# EAGLE design uC_Board (EAGLE 9.0.0)
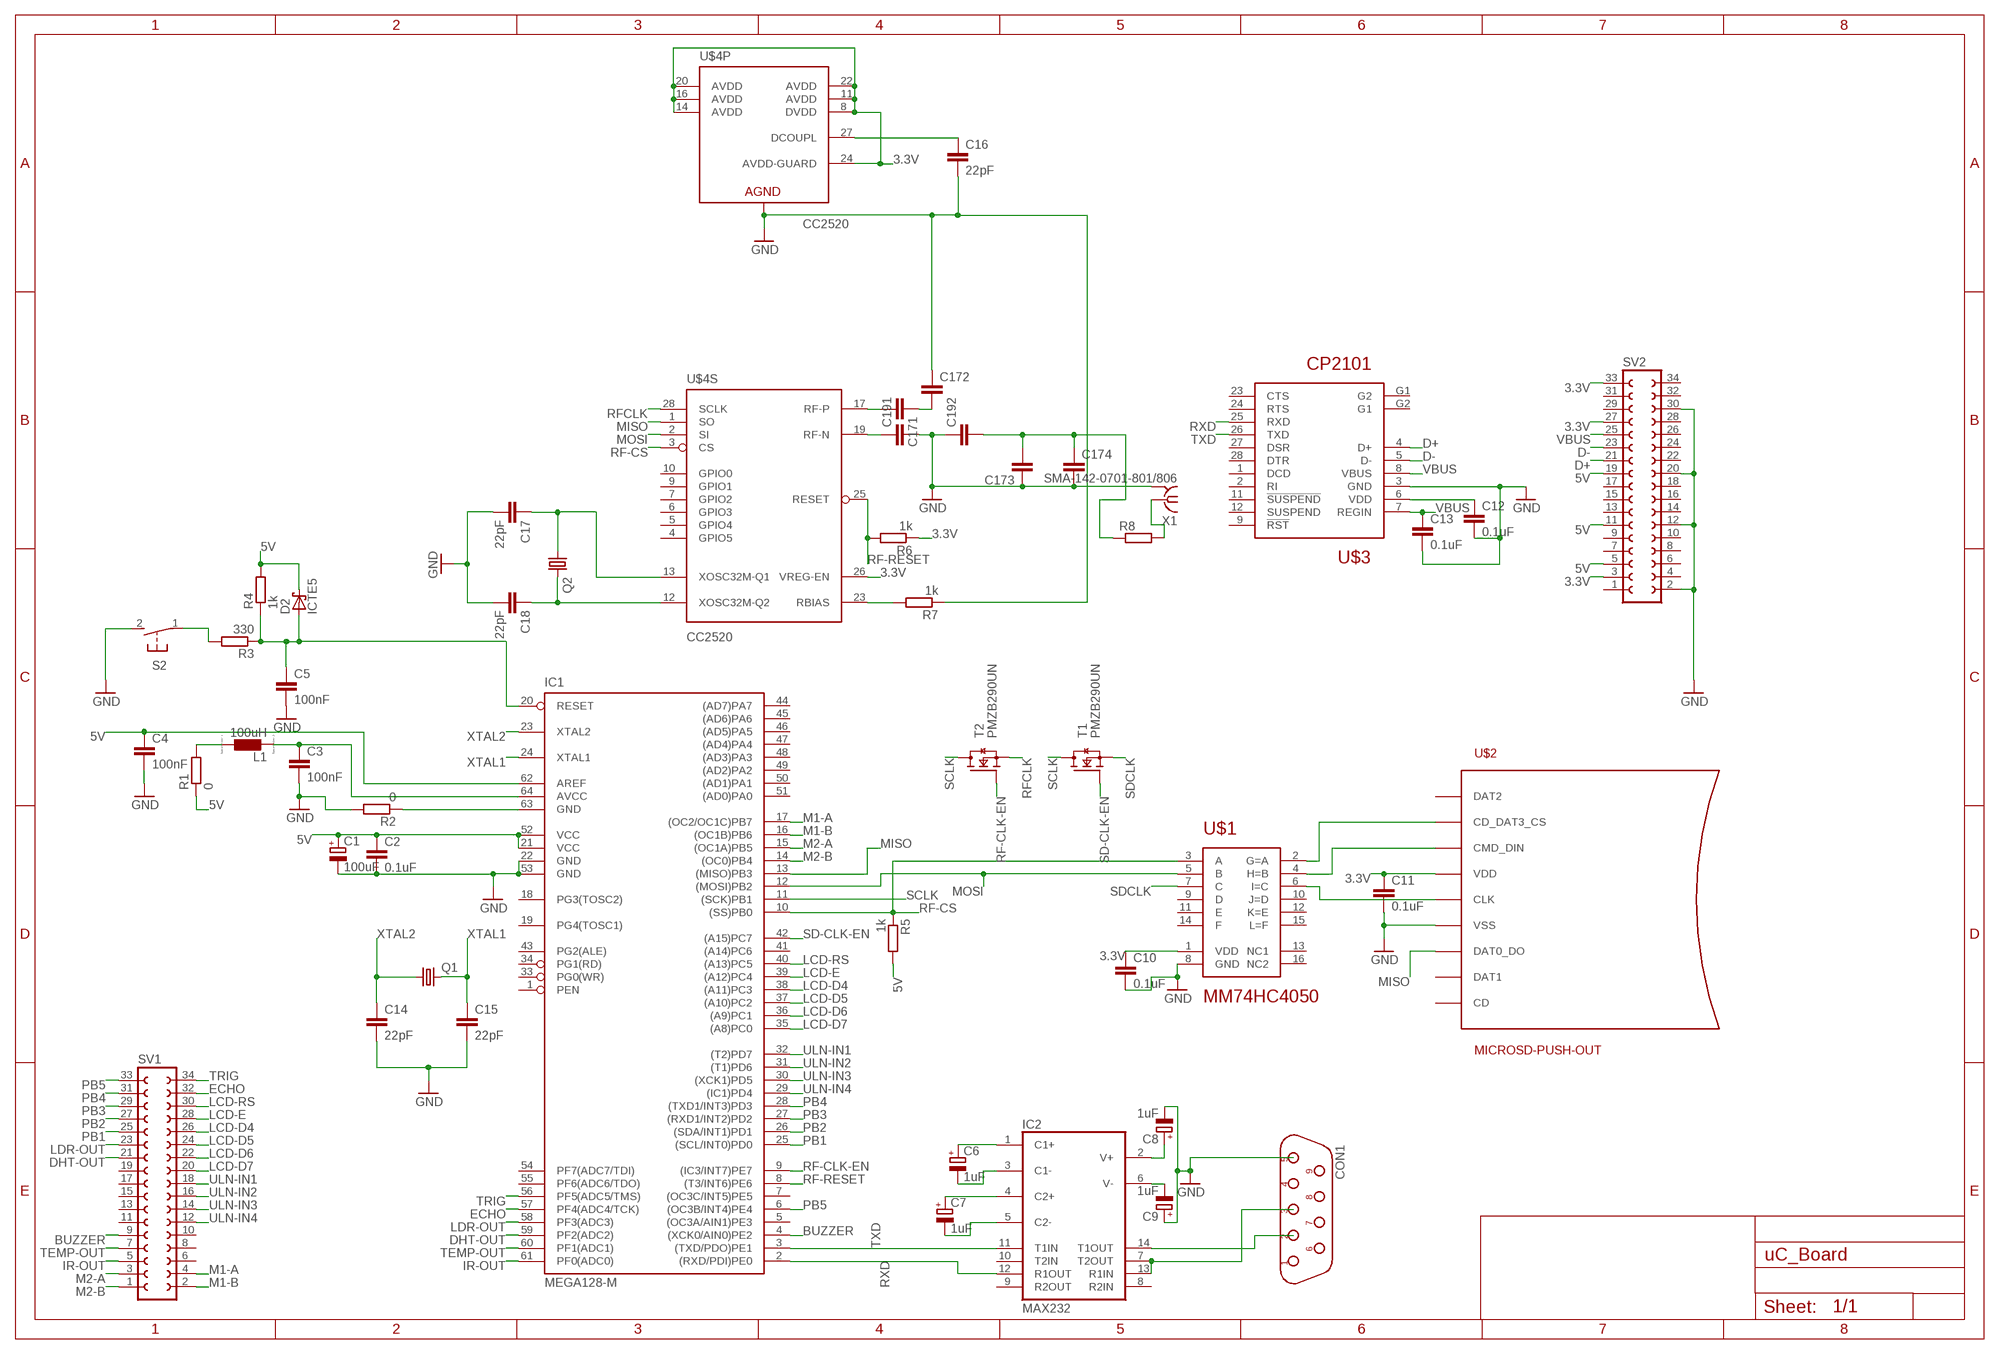
[diagram p0: schematic, sheet 1]

## Parts
C1  100uF  CPOL-EUCT3528  [CT3528]
C2  0.1uF  C-EUC0805  [C0805]
C3  100nF  C-EUC0805  [C0805]
C4  100nF  C-EUC0805  [C0805]
C5  100nF  C-EUC0805  [C0805]
C6  1uF  CPOL-EUCT3528  [CT3528]
C7  1uF  CPOL-EUCT3528  [CT3528]
C8  1uF  CPOL-EUCT3528  [CT3528]
C9  1uF  CPOL-EUCT3528  [CT3528]
C10  0.1uF  C-EUC0805  [C0805]
C11  0.1uF  C-EUC0805  [C0805]
C12  0.1uF  C-EUC0805  [C0805]
C13  0.1uF  C-EUC0805  [C0805]
C14  22pF  C-EUC0805  [C0805]
C15  22pF  C-EUC0805  [C0805]
C16  22pF  C-EUC0805  [C0805]
C17  22pF  C-EUC0805  [C0805]
C18  22pF  C-EUC0805  [C0805]
C171  C-EUC0201  [C0201]
C172  C-EUC0201  [C0201]
C173  C-EUC0201  [C0201]
C174  C-EUC0201  [C0201]
C191  C-EUC0201  [C0201]
C192  C-EUC0201  [C0201]
CON1  DB9F  [D-09F]
D2  ICTE5  [C4111-15]
IC1  MEGA128-M  [MLF64]
IC2  MAX232  [DIL16]
L1  100uH  L0207/10  [0207/10]
Q1  CRYSTALCTS406  [CTS406]
Q2  CRYSTALCTS406  [CTS406]
R1  0  R-EU_R0603  [R0603]
R2  0  R-EU_R0603  [R0603]
R3  330  R-EU_R0603  [R0603]
R4  1k  R-EU_R0603  [R0603]
R5  1k  R-EU_R0603  [R0603]
R6  1k  R-EU_R0603  [R0603]
R7  1k  R-EU_R0603  [R0603]
R8  R-EU_R0201  [R0201]
S2  31-XX  [B3F-31XX]
SV1  FE17-2W  [FE17-2W]
SV2  FE17-2W  [FE17-2W]
T1  PMZB290UN  [SOT883(B)]
T2  PMZB290UN  [SOT883(B)]
U$1  MM74HC4050  [MM74HC4050]
U$2  MICROSD-PUSH-OUT  [MICROSD-PUSH-OUT]
U$3  CP2101  [CP2101]
U$4  CC2520  [QFN50P500X500X100-29N]
X1  SMA-142-0701-801/806  [J502-ND-142-0701-801/806]

## Nets
3.3V: C10.1 C11.1 R6.1 SV2.3 SV2.27 SV2.33 U$1.1(VDD) U$2.4(VDD) U$4.8(P:DVDD) U$4.11(P:AVDD) U$4.14(P:AVDD) U$4.16(P:AVDD) U$4.20(P:AVDD) U$4.22(P:AVDD) U$4.24(P:AVDD-GUARD) U$4.26(S:VREG-EN)
5V: C1.+ C2.1 C4.1 D2.C IC1.21(VCC) IC1.52(VCC) IC1.62(AREF) L1.1 R1.1 R1.2 R4.2 R5.2 SV2.5 SV2.11 SV2.19
BUZZER: IC1.4((XCK0/AIN0)PE2) SV1.9
D+: SV2.21 U$3.4(D+)
D-: SV2.23 U$3.5(D-)
DHT-OUT: IC1.59(PF2(ADC2)) SV1.21
ECHO: IC1.57(PF4(ADC4/TCK)) SV1.32
GND: C1.- C2.2 C3.2 C4.2 C5.2 C8.- C9.+ C10.2 C11.2 C12.2 C13.2 C14.2 C15.2 C16.2 C17.2 C18.2 C172.1 C173.1 C174.2 C191.2 C192.1 CON1.5 IC1.22(GND) IC1.53(GND) R2.2 R7.1 S2.2(S) SV2.2 SV2.12 SV2.20 SV2.30 U$1.8(GND) U$2.6(VSS) U$2.G1(VSS) U$2.G2(VSS) U$2.G3(VSS) U$2.G4(VSS) U$3.3(GND) U$4.29(P:AGND) X1.G@1 X1.G@2 X1.G@3 X1.G@4
IR-OUT: IC1.61(PF0(ADC0)) SV1.5
LCD-D4: IC1.38((A11)PC3) SV1.26
LCD-D5: IC1.37((A10)PC2) SV1.24
LCD-D6: IC1.36((A9)PC1) SV1.22
LCD-D7: IC1.35((A8)PC0) SV1.20
LCD-E: IC1.39((A12)PC4) SV1.28
LCD-RS: IC1.40((A13)PC5) SV1.30
LDR-OUT: IC1.58(PF3(ADC3)) SV1.23
M1-A: IC1.17((OC2/OC1C)PB7) SV1.4
M1-B: IC1.16((OC1B)PB6) SV1.2
M2-A: IC1.15((OC1A)PB5) SV1.3
M2-B: IC1.14((OC0)PB4) SV1.1
MISO: IC1.13((MISO)PB3) U$2.7(DAT0_DO) U$4.1(S:SO)
MOSI: IC1.12((MOSI)PB2) U$1.5(B) U$4.2(S:SI)
N$1: IC1.63(GND) R2.1
N$2: C3.1 IC1.64(AVCC) L1.2
N$3: U$1.2(G=A) U$2.2(CD_DAT3_CS)
N$4: C5.1 D2.A IC1.20(RESET) R3.1 R4.1
N$5: R3.2 S2.1(P)
N$6: C16.1 U$4.27(P:DCOUPL)
N$7: C6.+ IC2.1(C1+)
N$8: C6.- IC2.3(C1-)
N$9: C7.+ IC2.4(C2+)
N$10: C7.- IC2.5(C2-)
N$11: C9.- IC2.6(V-)
N$12: C8.+ IC2.2(V+)
N$13: R7.2 U$4.23(S:RBIAS)
N$14: CON1.2 IC2.14(T1OUT)
N$15: CON1.3 IC2.7(T2OUT) IC2.13(R1IN)
N$16: C171.2 U$4.17(S:RF-P)
N$17: C171.1 C172.2
N$18: C191.1 U$4.19(S:RF-N)
N$19: U$1.4(H=B) U$2.3(CMD_DIN)
N$20: U$1.6(I=C) U$2.5(CLK)
N$22: C173.2 C174.1 C192.2 R8.1
N$23: R8.2 X1.1
N$27: C12.1 U$3.6(VDD)
PB1: IC1.25((SCL/INT0)PD0) SV1.25
PB2: IC1.26((SDA/INT1)PD1) SV1.27
PB3: IC1.27((RXD1/INT2)PD2) SV1.29
PB4: IC1.28((TXD1/INT3)PD3) SV1.31
PB5: IC1.6((OC3B/INT4)PE4) SV1.33
RF-CLK-EN: IC1.9((IC3/INT7)PE7) T2.1(G)
RF-CS: IC1.10((SS)PB0) R5.1 U$1.3(A) U$4.3(S:CS)
RF-RESET: IC1.8((T3/INT6)PE6) R6.2 U$4.25(S:RESET)
RFCLK: T2.2(S) U$4.28(S:SCLK)
RXD: IC1.2((RXD/PDI)PE0) IC2.12(R1OUT) U$3.25(RXD)
SCLK: IC1.11((SCK)PB1) T1.3(D) T2.3(D)
SD-CLK-EN: IC1.42((A15)PC7) T1.1(G)
SDCLK: T1.2(S) U$1.7(C)
TEMP-OUT: IC1.60(PF1(ADC1)) SV1.7
TRIG: IC1.56(PF5(ADC5/TMS)) SV1.34
TXD: IC1.3((TXD/PDO)PE1) IC2.11(T1IN) U$3.26(TXD)
ULN-IN1: IC1.32((T2)PD7) SV1.18
ULN-IN2: IC1.31((T1)PD6) SV1.16
ULN-IN3: IC1.30((XCK1)PD5) SV1.14
ULN-IN4: IC1.29((IC1)PD4) SV1.12
VBUS: C13.1 SV2.25 U$3.7(REGIN) U$3.8(VBUS)
XTAL1: C15.1 IC1.24(XTAL1) Q1.3
XTAL2: C14.1 IC1.23(XTAL2) Q1.1
XTAL3: C17.1 Q2.1 U$4.13(S:XOSC32M-Q1)
XTAL4: C18.1 Q2.3 U$4.12(S:XOSC32M-Q2)
Unconnected: CON1.1 CON1.4 CON1.6 CON1.7 CON1.8 CON1.9 IC1.1(PEN) IC1.5((OC3A/AIN1)PE3) IC1.7((OC3C/INT5)PE5) IC1.18(PG3(TOSC2)) IC1.19(PG4(TOSC1)) IC1.33(PG0(WR)) IC1.34(PG1(RD)) IC1.41((A14)PC6) IC1.43(PG2(ALE)) IC1.44((AD7)PA7) IC1.45((AD6)PA6) IC1.46((AD5)PA5) IC1.47((AD4)PA4) IC1.48((AD3)PA3) IC1.49((AD2)PA2) IC1.50((AD1)PA1) IC1.51((AD0)PA0) IC1.54(PF7(ADC7/TDI)) IC1.55(PF6(ADC6/TDO)) IC2.8(R2IN) IC2.9(R2OUT) IC2.10(T2IN) SV1.6 SV1.8 SV1.10 SV1.11 SV1.13 SV1.15 SV1.17 SV1.19 SV2.1 SV2.4 SV2.6 SV2.7 SV2.8 SV2.9 SV2.10 SV2.13 SV2.14 SV2.15 SV2.16 SV2.17 SV2.18 SV2.22 SV2.24 SV2.26 SV2.28 SV2.29 SV2.31 SV2.32 SV2.34 U$1.9(D) U$1.10(J=D) U$1.11(E) U$1.12(K=E) U$1.13(NC1) U$1.14(F) U$1.15(L=F) U$1.16(NC2) U$2.1(DAT2) U$2.8(DAT1) U$2.CD U$3.1(DCD) U$3.2(RI) U$3.9(!RST) U$3.11(!SUSPEND) U$3.12(SUSPEND) U$3.23(CTS) U$3.24(RTS) U$3.27(DSR) U$3.28(DTR) U$3.G1(G2) U$3.G2(G1) U$4.4(S:GPIO5) U$4.5(S:GPIO4) U$4.6(S:GPIO3) U$4.7(S:GPIO2) U$4.9(S:GPIO1) U$4.10(S:GPIO0) U$4.15(NC) U$4.18(NC) U$4.21(NC)

## Power pins joined to a net without a drawn wire
GND: IC2.15(GND)
VCC: IC2.16(VCC)

## Library data of the parts
C1 C6-C9 = rcl:CPOL-EU: POLARIZED CAPACITOR, European symbol; SPICEPREFIX: C
C2-C5 C10-C18 C171-C174 C191 C192 = rcl:C-EU: CAPACITOR, European symbol; SPICEPREFIX: C
CON1 = connect:DB9F
D2 = diode:ICTE5: Transient-suppressor DIODE
IC1 = atmel:MEGA128: MICROCONTROLLER 128 Kbytes FLASH 4 Kbytes SRAM 4 Kbytes EEPROM DUAL USART 8-channel 10 bit ADC Source: avr.lbr; MPN: ATMEGA128-16MU; OC_FARNELL: 1455093; OC_NEWARK: 58M3717
IC2 = maxim:MAX232: RS232 TRANSCEIVER; MF: MAXIM; MPN: MAX232ACPE+; OC_FARNELL: 9723773; OC_NEWARK: 68K4544
L1 = eagle-ltspice:L: INDUCTOR, European symbol; SPICEMODEL: NONE; SPICEPREFIX: L
Q1 Q2 = crystal:CRYSTAL: CRYSTAL; OC_FARNELL: unknown; OC_NEWARK: unknown
R1-R8 = rcl:R-EU_: RESISTOR, European symbol; SPICEPREFIX: R
S2 = switch-omron:31-XX: OMRON SWITCH; MPN: B3F-3100; OC_FARNELL: 959704; OC_NEWARK: 36M3582
SV1 SV2 = con-lsta:FE17-2W: FEMALE HEADER; OC_FARNELL: unknown; OC_NEWARK: unknown
T1 T2 = NXP_60_26022015:PMZB290UN: 20 V, single N-channel Trench MOSFET AAL Eindhoven MK
U$1 = MM74HC4050:MM74HC4050
U$2 = microsd:MICROSD-PUSH-OUT: T-Flash Push-Out Micro SD Card Reader 14.75mm x 14.5mm SMD with external pins
U$3 = CP2101-QFN28:CP2101: USB to UART line driver, QFN28 package
U$4 = chipcon-ti-v2:CC2520: 2.4 GHZ IEEE 802.15.4/ZIGBEE® RF TRANSCEIVER
X1 = con-coax:SMA-: SMA 50 Ohm End Launch Jack Receptacle - Round Contact Johnson Components Source: www.johnsoncomponents.com .. J502-ND.pdf; MF: JOHNSON COMPONENTS; MPN: 142-0701-801; OC_FARNELL: 1608592; OC_NEWARK: 90F2624

## Board
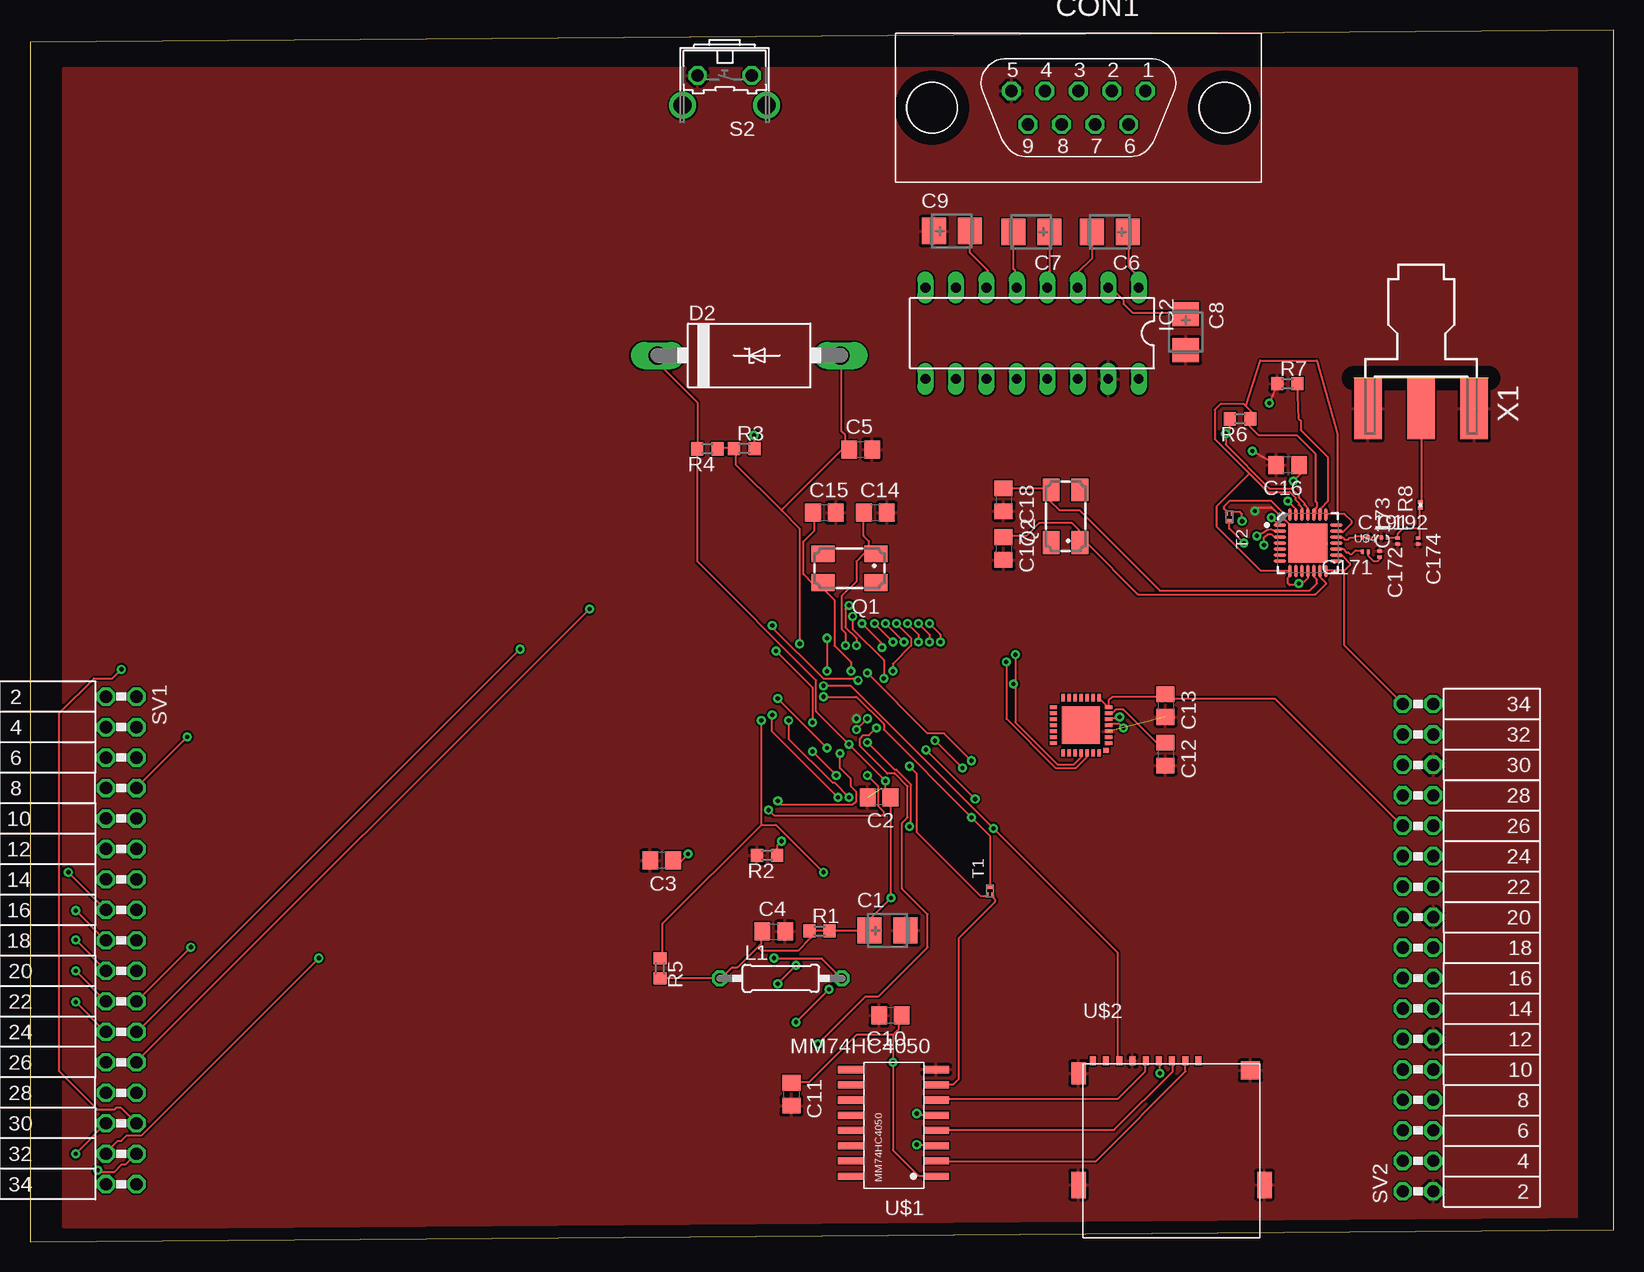
[diagram p1: board, top side]
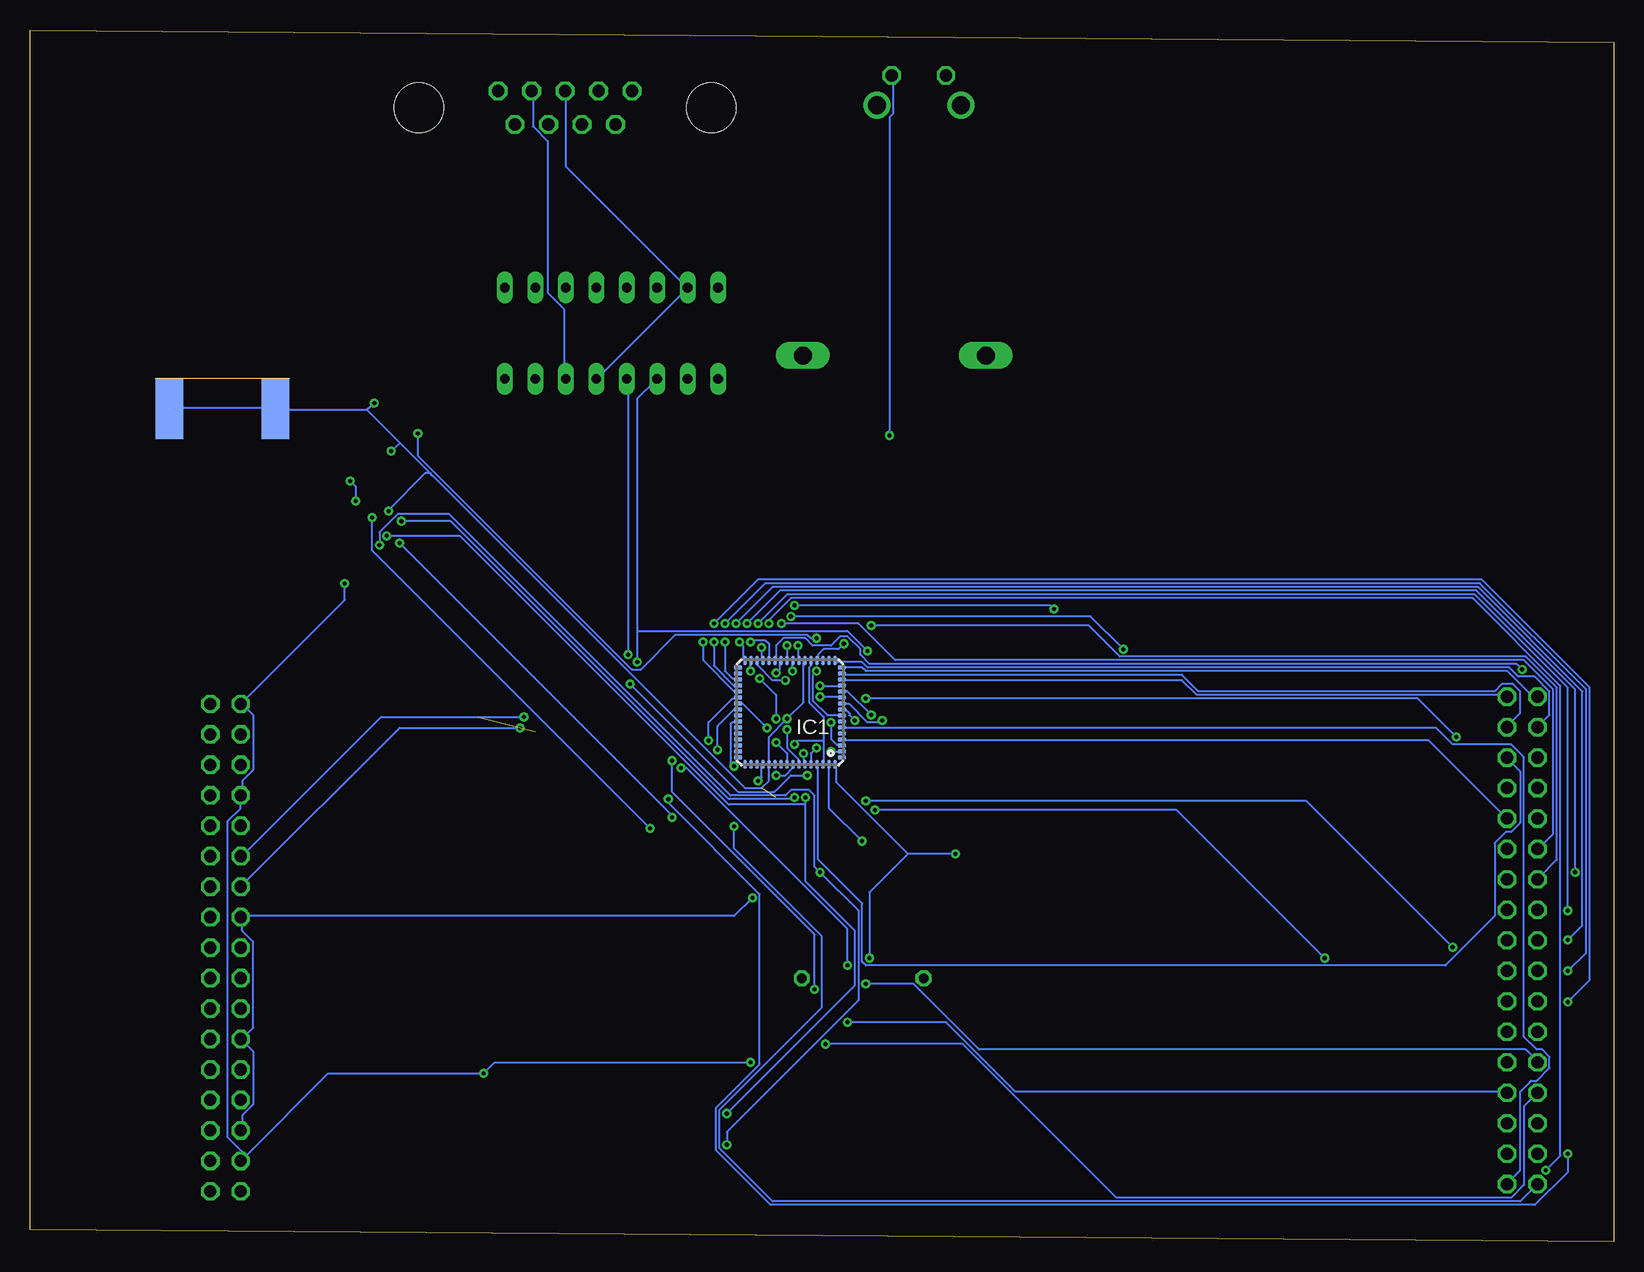
[diagram p2: board, bottom side, seen from below]

Size 132 x 101 mm. Coordinates in mm from the lower left corner, seen from the top.
Outline: 0,0 132,1 132,101 0,100 0,0
Copper layers (1*16): Top 0.035mm / dielectric 1.5mm / Bottom 0.035mm
Design rules "default *": minimum track width 6mil, minimum drill 0.35mm, track to track 6mil, track to pad 6mil, pad to pad 6mil, via to via 6mil, smd to smd 6mil, copper to edge 40mil, drill to drill 6mil, minimum pad ring 10mil, minimum via ring 8mil, stop-mask expansion 4mil, vias tented up to drill 0mil, thermal gap 10mil

### Footprints (pad centres in the part's own frame; a part is rotated, then mirrored left to right if it is on the bottom)
CT3528 = smd 2 x 2.2: + -1.5,0; - 1.5,0
C0805 = smd 1.3 x 1.5: 1 -0.95,0; 2 0.95,0
C0201 = smd 0.25 x 0.35: 1 -0.25,0; 2 0.25,0
D-09F = drill 1.016 pad 1.575 octagon: 1 5.588,1.397; 2 2.794,1.397; 3 0,1.397; 4 -2.794,1.397; 5 -5.588,1.397; 6 4.191,-1.397; 7 1.397,-1.397; 8 -1.397,-1.397; 9 -4.191,-1.397 | hole 4.115: 12.192,0; -12.192,0
C4111-15 = drill 1.499 long: A 7.62,0; C -7.62,0
MLF64 = smd 0.7 x 0.3: 1 -4.325,3.75; 2 -4.325,3.25; 3 -4.325,2.75; 4 -4.325,2.25; 5 -4.325,1.75; 6 -4.325,1.25; 7 -4.325,0.75; 8 -4.325,0.25; 9 -4.325,-0.25; 10 -4.325,-0.75; 11 -4.325,-1.25; 12 -4.325,-1.75; 13 -4.325,-2.25; 14 -4.325,-2.75; 15 -4.325,-3.25; 16 -4.325,-3.75; 33 4.325,-3.75; 34 4.325,-3.25; 35 4.325,-2.75; 36 4.325,-2.25; 37 4.325,-1.75; 38 4.325,-1.25; 39 4.325,-0.75; 40 4.325,-0.25; 41 4.325,0.25; 42 4.325,0.75; 43 4.325,1.25; 44 4.325,1.75; 45 4.325,2.25; 46 4.325,2.75; 47 4.325,3.25; 48 4.325,3.75 | smd 0.3 x 0.7: 17 -3.75,-4.325; 18 -3.25,-4.325; 19 -2.75,-4.325; 20 -2.25,-4.325; 21 -1.75,-4.325; 22 -1.25,-4.325; 23 -0.75,-4.325; 24 -0.25,-4.325; 25 0.25,-4.325; 26 0.75,-4.325; 27 1.25,-4.325; 28 1.75,-4.325; 29 2.25,-4.325; 30 2.75,-4.325; 31 3.25,-4.325; 32 3.75,-4.325; 49 3.75,4.325; 50 3.25,4.325; 51 2.75,4.325; 52 2.25,4.325; 53 1.75,4.325; 54 1.25,4.325; 55 0.75,4.325; 56 0.25,4.325; 57 -0.25,4.325; 58 -0.75,4.325; 59 -1.25,4.325; 60 -1.75,4.325; 61 -2.25,4.325; 62 -2.75,4.325; 63 -3.25,4.325; 64 -3.75,4.325
DIL16 = drill 0.813 long: 1 -8.89,-3.81; 2 -6.35,-3.81; 3 -3.81,-3.81; 4 -1.27,-3.81; 5 1.27,-3.81; 6 3.81,-3.81; 7 6.35,-3.81; 8 8.89,-3.81; 9 8.89,3.81; 10 6.35,3.81; 11 3.81,3.81; 12 1.27,3.81; 13 -1.27,3.81; 14 -3.81,3.81; 15 -6.35,3.81; 16 -8.89,3.81
0207/10 = drill 0.813 octagon: 1 -5.08,0; 2 5.08,0
CTS406 = smd 1.9 x 1.4: 1 -2.2,-1.2; 2 2.2,-1.2; 3 2.2,1.2; 4 -2.2,1.2
R0603 = smd 1 x 1.1: 1 -0.85,0; 2 0.85,0
R0201 = smd 0.28 x 0.43: 1 -0.255,0; 2 0.255,0
B3F-31XX = drill 1.016 octagon: 1 -2.261,-1.245; 2 2.261,-1.245 | drill 1.499 pad 2.159: 3 -3.505,1.245; 4 3.505,1.245
FE17-2W = drill 1.016 octagon: 1 -20.32,1.27; 2 -20.32,-1.27; 3 -17.78,1.27; 4 -17.78,-1.27; 5 -15.24,1.27; 6 -15.24,-1.27; 7 -12.7,1.27; 8 -12.7,-1.27; 9 -10.16,1.27; 10 -10.16,-1.27; 11 -7.62,1.27; 12 -7.62,-1.27; 13 -5.08,1.27; 14 -5.08,-1.27; 15 -2.54,1.27; 16 -2.54,-1.27; 17 0,1.27; 18 0,-1.27; 19 2.54,1.27; 20 2.54,-1.27; 21 5.08,1.27; 22 5.08,-1.27; 23 7.62,1.27; 24 7.62,-1.27; 25 10.16,1.27; 26 10.16,-1.27; 27 12.7,1.27; 28 12.7,-1.27; 29 15.24,1.27; 30 15.24,-1.27; 31 17.78,1.27; 32 17.78,-1.27; 33 20.32,1.27; 34 20.32,-1.27
SOT883(B) = smd 0.4 x 0.25: 1 -0.35,0.225; 2 -0.35,-0.225 | smd 0.4 x 0.7: 3 0.35,0
MM74HC4050 = smd 0.6 x 2.13: 1 0,0; 2 1.27,0; 3 2.54,0; 4 3.81,0; 5 5.08,0; 6 6.35,0; 7 7.62,0; 8 8.89,0; 9 8.89,7.14; 10 7.62,7.14; 11 6.35,7.14; 12 5.08,7.14; 13 3.81,7.14; 14 2.54,7.14; 15 1.27,7.14; 16 0,7.14
MICROSD-PUSH-OUT = smd 0.5 x 0.75: 1 9.625,0.225; 2 8.525,0.225; 3 7.425,0.225; 4 6.325,0.225; 5 5.225,0.225; 6 4.125,0.225; 7 3.025,0.225; 8 1.925,0.225; CD 0.825,0.225 | smd 1.2 x 1.8: G1 -0.375,-0.8 | smd 1.2 x 2.2: G2 -0.375,-10.1; G4 15.125,-10.1 | smd 1.6 x 1.5: G3 13.95,-0.55
CP2101 = smd 0.6 x 0.3: 1 -2.3,1.5; 2 -2.3,1; 3 -2.3,0.5; 4 -2.3,0; 5 -2.3,-0.5; 6 -2.3,-1; 7 -2.3,-1.5; 15 2.3,-1.5; 16 2.3,-1; 17 2.3,-0.5; 18 2.3,0; 19 2.3,0.5; 20 2.3,1; 21 2.3,1.5 | smd 0.3 x 0.6: 8 -1.5,-2.3; 9 -1,-2.3; 10 -0.5,-2.3; 11 0,-2.3; 12 0.5,-2.3; 13 1,-2.3; 14 1.5,-2.3; 22 1.5,2.3; 23 1,2.3; 24 0.5,2.3; 25 0,2.3; 26 -0.5,2.3; 27 -1,2.3; 28 -1.5,2.3 | smd 0.435 x 0.435: G1 -2.103,2.103 | smd 3.15 x 3.15: G2 0,0
QFN50P500X500X100-29N = smd 1.05 x 0.3: 1 -2.35,1.5; 2 -2.35,1; 3 -2.35,0.5; 4 -2.35,0; 5 -2.35,-0.5; 6 -2.35,-1; 7 -2.35,-1.5; 15 2.35,-1.5; 16 2.35,-1; 17 2.35,-0.5; 18 2.35,0; 19 2.35,0.5; 20 2.35,1; 21 2.35,1.5 | smd 0.3 x 1.05: 8 -1.5,-2.35; 9 -1,-2.35; 10 -0.5,-2.35; 11 0,-2.35; 12 0.5,-2.35; 13 1,-2.35; 14 1.5,-2.35; 22 1.5,2.35; 23 1,2.35; 24 0.5,2.35; 25 0,2.35; 26 -0.5,2.35; 27 -1,2.35; 28 -1.5,2.35 | smd 3.25 x 3.25: 29 0,0
J502-ND-142-0701-801/806 = smd 5.08 x 2.286: 1 2.565,0; G@1 2.565,4.42; G@2 2.565,-4.42 | smd 5.08 x 2.286 bottom: G@3 2.565,4.42; G@4 2.565,-4.42

### Placement (x,y rotation side)
C1  71.48,25.94 0 top
C2  70.78,37.04 180 top
C3  52.65,31.76 180 top
C4  62,25.84 0 top
C5  69.25,66.04 0 top
C6  90.01,84.16 180 top
C7  83.46,84.16 180 top
C8  96.34,75.81 270 top
C9  76.84,84.24 0 top
C10  71.73,18.84 180 top
C11  63.46,12.28 270 top
C12  94.66,40.63 270 top
C13  94.66,44.68 270 top
C14  70.47,60.76 0 top
C15  66.22,60.76 0 top
C16  104.83,64.74 180 top
C17  81.16,57.78 270 top
C18  81.16,61.83 270 top
C171  111.3,57.5 180 top
C172  112.5,57.3 270 top
C173  114,58.4 90 top
C174  115.7,58.4 270 top
C191  111.3,58.7 0 top
C192  112.9,58.7 0 top
CON1  87.39,94.52 0 top
D2  59.95,73.87 0 top
IC1  68.65,44.11 180 bottom
IC2  83.53,75.72 180 top
L1  62.59,21.94 0 top
Q1  68.31,56.13 180 top
Q2  86.33,60.47 90 top
R1  65.81,25.89 0 top
R2  61.44,32.19 180 top
R3  59.55,66.11 0 top
R4  56.46,66.09 180 top
R5  52.51,22.77 270 top
R6  100.88,68.59 180 top
R7  104.81,71.51 0 top
R8  115.9,61.4 90 top
S2  57.91,95.96 180 top
SV1  7.6,25.1 270 top
SV2  115.7,24.5 90 top
T1  80.01,29.24 90 top
T2  99.99,60.39 270 top
U$1  75.54,5.45 90 top
U$2  87.78,14.82 0 top
U$3  87.61,43.04 180 top
U$4  106.54,58.24 0 top
X1  115.96,72 270 top

### Tracks (layer width: path | path; a pad name or v marks a point on that pad's centre or on a via)
3.3V  (via drill 0.35)
  Top 0.152: 108.97,60.66 109.58,60.66 110.19,60.05 110.19,59.89 109.42,59.13 109.27,59.28 108.97,59.28 U$4.20 | 108.97,60.66 108.05,60.66 U$4.22 | 105.77,54.71 105.92,54.71 106.53,55.32 106.53,55.78 U$4.11 | 105.77,54.71 105,54.71 104.85,54.86 104.85,55.32 105,55.47 105,55.78 U$4.8 105,55.93 102.56,55.93 98.91,59.59 98.91,61.27 101.65,64.01 | 101.65,64.01 98.75,66.9 98.75,69.34 99.21,69.8 101.19,69.8 101.35,69.65 | 101.65,64.01 103.17,62.48 105,62.48 105.46,62.03 105.46,61.87 105.77,61.57 105.77,61.42 106.07,61.11 106.07,60.66 U$4.26 | 101.35,69.65 101.8,69.19 101.8,68.73 R6.1 101.65,68.58 101.65,67.97 102.41,67.21 105.61,67.21 107.14,65.68 107.14,61.72 107.29,61.57 107.29,61.27 107.14,61.11 107.14,60.66 U$4.24 | 108.97,60.66 108.97,67.36 107.28,73.45 102.55,73.45 101.35,69.65 | 109.58,55.93 108.05,55.93 U$4.14 | 109.58,55.93 110.03,56.39 110.03,56.54 109.42,57.15 108.97,57.15 U$4.16 | 109.58,55.93 109.58,49.68 114.3,44.96 SV2.33 | v105.77,54.86 105.77,54.71 | 71.93,17.22 68.89,17.22 64.92,13.26 63.55,13.26 C11.1 | 71.93,17.22 72.39,17.68 72.39,18.59 72.54,18.75 C10.1 | 71.93,17.22 v71.93,14.94 71.93,7.62 74.07,5.49 75.44,5.49 U$1.1 | v94.18,14.02 94.18,14.94 U$2.4
  Bottom 0.152: v105.77,54.86 105.77,53.49 114.3,44.96 SV2.33 114.3,44.81 113.39,43.89 113.39,39.32 114.3,38.41 114.3,37.34 SV2.27 114.45,37.19 114.45,36.12 115.52,35.05 115.52,8.69 114,7.16 | 114,7.16 114.3,6.86 SV2.3 114,7.16 | 114,7.16 107.14,14.02 v94.18,14.02 93.27,14.94 v71.93,14.94
5V  (via drill 0.35)
  Top 0.152: D2.C 52.43,73.76 52.43,73.15 55.63,69.95 55.63,66.14 R4.2 55.63,65.99 55.63,56.69 65.53,46.79 65.53,44.2 v68.28,41.45 v71.32,38.41 71.32,37.49 71.63,37.19 C2.1 71.78,37.03 v71.78,28.65 70.1,26.98 70.1,26.06 C1.+ 69.95,25.91 66.75,25.91 R1.2 66.6,25.91 65.08,25.91 R1.1 65.08,25.76 65.08,25.3 64.01,24.23 60.96,24.23 60.66,24.54 | R5.2 52.58,21.95 57.45,21.95 L1.1 57.61,21.95 58.52,22.86 58.98,22.86 60.66,24.54 | 60.66,24.54 60.96,24.84 60.96,25.76 C4.1
  Bottom 0.152: SV2.5 114.3,9.3 114.3,10.52 113.39,11.43 113.39,15.85 114.3,16.76 SV2.11 114.3,16.92 113.39,17.83 113.39,24.99 114.3,25.91 114.3,26.98 SV2.19 114.3,27.13 73.3,27.13 v71.78,28.65 | 65.84,41.76 65.84,43.74 67.06,44.96 67.06,47.85 66.9,48.01 66.9,48.31 IC1.21 | 65.84,41.76 65.84,39.93 IC1.62 | v71.32,38.41 71.02,38.71 71.02,39.78 IC1.52 | 65.84,41.76 67.97,41.76 v68.28,41.45
BUZZER
  Bottom 0.152: IC1.4 64.31,41.76 15.39,41.76 8.99,35.36 SV1.9
D+  (via drill 0.35)
  Top 0.152: v91.14,42.82 90.83,43.13 89.92,43.13 U$3.4
  Bottom 0.152: v91.14,42.82 101.19,42.82 114.3,29.72 SV2.21
D-  (via drill 0.35)
  Top 0.152: v90.83,43.74 90.68,43.59 89.92,43.59 U$3.5
  Bottom 0.152: v90.83,43.74 102.72,43.74 114.3,32.16 SV2.23
DHT-OUT  (via drill 0.35)
  Top 0.152: v67.51,40.69 67.51,39.47 68.43,38.56 68.43,37.95 68.89,37.49 68.89,36.73 68.58,36.42 62.64,36.42 v62.33,36.73 | v13.41,24.54 8.99,20.12 SV1.21
  Bottom 0.152: v67.51,40.69 67.51,39.93 IC1.59 | v62.33,36.73 25.6,36.73 v13.41,24.54
ECHO  (via drill 0.35)
  Top 0.152: v69.8,38.86 70.71,37.95 70.71,36.27 71.17,35.81 71.17,35.66 71.02,35.51 62.03,35.51 v61.57,35.97 | v24.08,23.62 9.3,8.84 8.08,8.84 7.62,8.38 7.32,8.38 6.4,7.47 SV1.32
  Bottom 0.152: v69.8,38.86 69.04,38.86 68.43,39.47 68.43,39.78 IC1.57 | v61.57,35.97 36.42,35.97 v24.08,23.62
GND  (via drill 0.35)  (3 unrouted)
  Top 0.152: R7.1 v103.3,69.9 | C16.2 v101.9,65.9 | v102.1,60.9 102.4,61.2 103.5,61.2 104.5,60.2 104.6,60.2 106.54,58.26 U$4.29
  Bottom 0.152: IC1.22 67.51,48.31 67.51,44.96 v68.89,43.59 70.41,42.06 70.41,39.93 IC1.53 70.41,38.41 71.02,37.8 72.39,37.8 98.4,63.8 98.55,63.95 98.65,64.05 | 103.94,69.34 101.15,66.55 | 101.15,66.55 98.65,64.05 | 103.94,69.34 111.4,69.34 X1.G@4 111.56,69.49 120.24,69.49 X1.G@3 | 103.94,69.34 v103.3,69.9 | 101.15,66.55 v101.9,65.9 | 98.65,64.05 99.05,64.05 102.1,61 v102.1,60.9
  pour Top: 4,97.8 128.9,97.8 128.9,1.2 2.8,1.2 2.8,97.8 3.9,97.8
IR-OUT
  Bottom 0.152: IC1.61 66.29,39.78 66.29,31.85 62.64,28.19 62.64,23.32 62.33,23.01 14.02,23.01 9.91,27.13 9.91,33.22 8.99,34.14 8.53,34.14 7.77,34.9 7.77,39.17 8.84,40.23 SV1.5
LCD-D4  (via drill 0.35)
  Top 0.152: v77.72,39.47 v75.44,41.76 | v62.33,21.49 v63.86,23.01
  Bottom 0.152: v75.44,41.76 75.44,43.28 73.46,45.26 73,45.26 IC1.38 | v77.72,39.47 77.27,39.47 63.86,26.06 v63.86,23.01 | v62.33,21.49 58.37,21.49 52.88,16 7.32,16 6.4,15.09 SV1.26
LCD-D5  (via drill 0.35)
  Top 0.152: v75.89,49.99 75.89,50.6 v74.98,51.51 | v3.81,19.96 6.25,17.53 SV1.24
  Bottom 0.152: v75.89,49.99 75.89,48.46 73.3,45.87 73,45.87 IC1.37 | v74.98,51.51 71.32,55.17 10.97,55.17 1.98,46.18 1.98,21.79 v3.81,19.96
LCD-D6  (via drill 0.35)
  Top 0.152: v74.98,49.99 74.98,50.6 v74.07,51.51 | v3.81,22.55 6.25,20.12 SV1.22
  Bottom 0.152: v74.98,49.99 74.98,48.01 73.3,46.33 73,46.33 IC1.36 | v74.07,51.51 70.71,54.86 11.12,54.86 2.29,46.02 2.29,24.08 v3.81,22.55
LCD-D7  (via drill 0.35)
  Top 0.152: v74.07,49.99 74.07,50.6 v73.15,51.51 | v3.81,25.15 6.25,22.71 SV1.20
  Bottom 0.152: v74.07,49.99 74.07,47.55 73.46,46.94 73,46.94 IC1.35 | v73.15,51.51 70.1,54.56 11.28,54.56 2.59,45.87 2.59,26.36 v3.81,25.15
LCD-E  (via drill 0.35)
  Top 0.152: v70.56,42.82 69.95,42.22 69.49,42.22 69.19,41.91 69.19,41.3 71.48,39.01 72.08,39.01 73.15,37.95 73.15,35.36 72.69,34.9 72.69,29.41 74.83,27.28 74.83,24.54 70.71,20.42 69.65,20.42 v65.68,16.46
  Bottom 0.152: v70.56,42.82 72.54,44.81 72.85,44.81 IC1.39 | v65.68,16.46 54.25,16.46 41.45,3.66 8.53,3.66 7.47,4.72 7.47,11.28 6.4,12.34 SV1.28
LCD-RS  (via drill 0.35)
  Top 0.152: v78.79,36.88 v74.68,41 | v3.81,7.32 6.25,9.75 SV1.30
  Bottom 0.152: v74.68,41 74.68,42.98 73.3,44.35 73,44.35 IC1.40 | v78.79,36.88 78.79,36.58 71.17,28.96 71.17,14.78 74.83,11.12 74.83,7.62 70.26,3.05 6.55,3.05 3.81,5.79 v3.81,7.32
LDR-OUT  (via drill 0.35)
  Top 0.152: v69.8,43.59 v68.89,42.67 | v71.17,46.94 71.17,48.46 68.58,51.05 v68.58,52.12 | v40.84,49.38 8.99,17.53 SV1.23
  Bottom 0.152: v68.89,42.67 68.89,41.15 67.97,40.23 67.97,39.93 IC1.58 | v69.8,43.59 69.8,45.57 v71.17,46.94 | v68.58,52.12 43.59,52.12 v40.84,49.38
M1-A
  Bottom 0.152: IC1.17 64.77,48.31 62.64,48.31 62.18,47.85 8.69,47.85 7.92,47.09 6.55,47.09 5.33,45.87 5.33,43.89 6.25,42.98 SV1.4
M1-B
  Bottom 0.152: IC1.16 64.31,47.85 62.64,47.85 62.33,47.55 8.84,47.55 6.86,45.57 6.4,45.57 SV1.2
M2-A
  Bottom 0.152: IC1.15 64.31,47.24 35.97,47.24 34.59,45.87 9.91,45.87 9.3,46.48 8.38,46.48 7.77,45.87 7.77,44.04 8.84,42.98 SV1.3
M2-B
  Bottom 0.152: IC1.14 64.31,46.79 35.97,46.79 34.75,45.57 8.99,45.57 SV1.1
MISO  (via drill 0.35)
  Top 0.152: v66.14,46.33 68.43,46.33 v80.31,34.44 90.68,24.08 90.68,15.09 U$2.7 | v103.48,60.35 104.09,59.74 U$4.1
  Bottom 0.152: v66.14,46.33 64.47,46.33 IC1.13 | v103.48,60.35 103.48,57.61 v80.31,34.44
MOSI  (via drill 0.35)
  Top 0.152: v61.87,43.89 61.87,42.52 v67.36,37.03 | v73.91,10.67 74.07,10.52 75.44,10.52 U$1.5 | v102.26,58.83 103.17,59.34 103.43,59.38 103.69,59.28 U$4.2
  Bottom 0.152: v61.87,43.89 63.86,45.87 64.31,45.87 IC1.12 | 67.36,36.42 67.36,30.02 63.25,25.91 63.25,21.34 v73.91,10.67 | 67.36,36.42 v67.36,37.03 | v102.26,58.83 96.16,58.83 73.76,36.42 67.36,36.42
N$1  (via drill 0.35)
  Top 0.152: v62.64,33.38 62.33,33.07 62.33,32.31 R2.1
  Bottom 0.152: v62.64,33.38 65.38,36.12 65.38,39.78 IC1.63
N$2  (via drill 0.35)
  Top 0.152: v54.86,32.31 54.25,31.7 53.65,31.7 C3.1 | v62.03,23.62 65.99,23.62 L1.2
  Bottom 0.152: 58.83,32.31 64.77,38.25 64.77,39.78 IC1.64 | v54.86,32.31 58.83,32.31 | v62.03,23.62 62.03,29.11 58.83,32.31
N$3
  Top 0.152: U$2.2 96.32,14.94 96.32,14.17 88.85,6.71 75.59,6.71 U$1.2
N$4  (via drill 0.35)
  Top 0.152: v64.16,49.84 64.16,59.44 62.64,60.96 | 62.64,60.96 58.83,64.77 58.83,65.99 R3.1 58.67,66.14 57.45,66.14 R4.1 | 67.97,65.99 67.67,65.99 62.64,60.96 | 67.97,65.99 68.28,65.99 C5.1 67.97,65.99 | 67.97,65.99 67.97,67.21 67.67,67.51 67.67,73.76 D2.A
  Bottom 0.152: v64.16,49.84 64.62,49.38 65.84,49.38 66.29,48.92 66.29,48.46 IC1.20
N$5  (via drill 0.35)
  Top 0.152: v60.35,67.21 60.35,66.14 R3.2
  Bottom 0.152: v60.35,67.21 60.35,93.73 60.05,94.03 60.05,97.08 S2.1
N$6  (via drill 0.35)
  Top 0.152: v104.85,61.72 105.46,61.11 105.46,60.66 U$4.27 | v105.31,63.4 105.92,64.01 105.92,64.62 C16.1
  Bottom 0.152: v104.85,61.72 104.85,62.94 v105.31,63.4
N$7
  Top 0.152: C6.+ 91.59,84.12 91.59,81.23 92.35,80.47 92.35,79.55 IC2.1
N$8
  Top 0.152: C6.- 88.54,84.12 88.54,81.99 87.33,80.77 87.33,79.55 IC2.3
N$9
  Top 0.152: C7.+ 85.04,84.12 85.04,80.92 84.89,80.77 84.89,79.55 IC2.4
N$10
  Top 0.152: C7.- 81.99,84.12 81.99,81.08 82.14,80.92 82.14,79.55 IC2.5
N$11
  Top 0.152: C9.- 78.33,84.12 78.33,82.45 79.86,80.92 79.7,80.77 79.7,79.55 IC2.6
N$12
  Top 0.152: C8.+ 96.32,77.42 91.9,77.42 91.14,78.18 91.14,78.49 90.22,79.4 89.92,79.4 IC2.2
N$13
  Top 0.152: U$4.23 107.59,60.66 107.59,61.11 108.2,61.72 108.2,65.38 105.92,67.67 105.92,68.43 105.77,68.58 R7.2
N$14
  Bottom 0.152: IC2.14 87.48,71.93 87.48,77.72 88.85,79.1 88.85,91.75 90.07,92.96 90.07,95.86 CON1.2
N$15
  Bottom 0.152: IC2.13 84.73,71.93 77.27,79.4 IC2.7 77.27,79.55 87.33,89.61 87.33,95.86 CON1.3
N$16
  Top 0.152: C171.2 110.95,57.61 110.49,57.61 110.19,57.3 110.03,57.3 109.88,57.45 109.73,57.45 109.42,57.76 108.97,57.76 U$4.17
N$17
  Top 0.152: C171.1 111.56,57.45 111.56,57.15 112.01,56.69 112.32,56.69 112.62,57 C172.2
N$18
  Top 0.152: C191.1 110.95,58.83 110.49,58.83 110.34,58.67 110.03,58.67 109.88,58.52 109.58,58.52 109.42,58.67 108.97,58.67 U$4.19
N$19
  Top 0.152: U$2.3 95.25,14.94 95.25,14.17 90.37,9.3 75.59,9.3 U$1.4
N$20
  Top 0.152: U$2.5 92.96,14.94 92.96,14.17 90.68,11.89 75.59,11.89 U$1.6
N$21  (via drill 0.35)
  other vias: 103.3,69.9
N$22
  Top 0.152: 114,58.67 113.23,58.67 C192.2 | 115.82,59.44 115.82,61.11 R8.1 | 115.82,59.44 115.82,58.67 C174.1 | 114,58.67 114,58.98 114.45,59.44 115.82,59.44 | 114,58.67 C173.2
N$23
  Top 0.152: R8.2 115.98,61.72 115.98,69.34 X1.1
N$24  (via drill 0.35)
  other vias: 101.9,65.9
N$27
  Top 0.152: U$3.6 90.22,44.04 90.53,44.35 91.14,44.35 93.88,41.6 94.64,41.6 C12.1
PB1  (via drill 0.35)
  Top 0.152: v68.89,49.68 68.89,50.29 67.97,51.21 67.97,52.73 v68.28,53.03 | v46.63,52.73 8.99,15.09 SV1.25
  Bottom 0.152: v68.89,49.68 68.89,48.46 IC1.25 | v68.28,53.03 46.94,53.03 v46.63,52.73
PB2  (via drill 0.35)
  Top 0.152: v69.8,47.4 74.83,42.37 76.2,42.37 v78.49,40.08 | v63.86,18.29 v66.6,21.03
  Bottom 0.152: v69.8,47.4 69.49,47.7 69.49,48.31 IC1.26 | v78.49,40.08 78.49,37.49 66.6,25.6 v66.6,21.03 | v63.86,18.29 55.63,18.29 49.84,12.5 8.99,12.5 SV1.27
PB3  (via drill 0.35)
  Top 0.152: v7.62,47.7 6.86,46.94 5.33,46.94 2.44,44.04 2.44,14.17 5.64,10.97 7.01,10.97 7.16,11.12 7.62,11.12 8.84,9.91 SV1.29
  Bottom 0.152: v7.62,47.7 8.08,48.16 62.03,48.16 62.79,48.92 62.79,49.38 63.86,50.44 64.47,50.44 65.23,49.68 66.75,49.68 67.36,50.29 69.19,50.29 69.8,49.68 69.8,48.46 IC1.27
PB4  (via drill 0.35)
  Top 0.152: v70.41,51.51 v71.93,49.99 | v5.64,5.94 5.79,5.79 7.01,5.79 7.62,6.4 7.92,6.4 8.84,7.32 SV1.31
  Bottom 0.152: v71.93,49.99 71.78,50.14 70.71,50.14 70.41,49.84 70.41,48.46 IC1.28 | v70.41,51.51 70.41,51.82 68.58,53.65 11.73,53.65 4.42,46.33 4.42,7.16 v5.64,5.94
PB5
  Bottom 0.152: IC1.6 64.31,42.82 14.78,42.82 13.41,41.45 8.53,41.45 7.47,40.39 7.47,17.07 6.4,16 5.94,16 5.33,15.39 5.33,14.48 6.4,13.41 6.86,13.41 7.77,12.5 7.77,5.94 8.84,4.88 SV1.33
RF-CLK-EN  (via drill 0.35)
  Top 0.152: v101.04,60.05 101.04,60.66 100.89,60.81 100.28,60.81 T2.1 | v68.28,37.03 67.06,38.25 66.9,38.25 63.25,41.91 v63.25,43.43
  Bottom 0.152: v101.04,60.05 96.93,60.05 73.76,36.88 68.43,36.88 v68.28,37.03 | v63.25,43.43 63.7,43.89 63.7,44.04 64.01,44.35 64.31,44.35 IC1.9
RF-CS  (via drill 0.35)
  Top 0.152: 60.96,34.75 v60.96,43.43 | 60.96,34.75 52.73,26.52 52.73,23.77 52.58,23.62 R5.1 | v102.87,58.06 102.87,58.67 103.17,58.98 103.48,58.98 103.78,58.67 104.09,58.67 U$4.3 | v66.14,30.79 62.18,34.75 60.96,34.75 | v73.91,8.08 75.44,8.08 U$1.3
  Bottom 0.152: v60.96,43.43 61.11,43.28 62.18,43.28 63.7,44.81 64.31,44.81 IC1.10 | v102.87,58.06 102.87,59.13 101.35,60.66 97.08,60.66 73.61,37.19 69.04,37.19 68.58,37.64 67.06,37.64 66.6,37.19 66.6,31.24 v66.14,30.79 62.94,27.58 62.94,20.12 73.91,9.14 v73.91,8.08
RF-RESET  (via drill 0.35)
  Top 0.152: v66.45,50.29 v66.45,47.55 | R6.2 99.97,68.58 99.97,67.67 v99.67,67.36 99.67,66.45 103.33,62.79 105.16,62.79 105.77,62.18 105.77,62.03 106.22,61.57 106.22,61.42 106.53,61.11 106.53,60.66 U$4.25
  Bottom 0.152: v66.45,47.55 66.75,47.24 66.75,45.11 65.53,43.89 64.47,43.89 IC1.8 | v66.45,50.29 66.9,50.29 67.21,50.6 78.18,50.6 81.08,47.7 81.84,47.7 99.67,65.53 v99.67,67.36
RFCLK
  Top 0.152: T2.2 99.67,60.81 99.67,60.96 99.52,61.11 99.52,61.27 99.97,61.72 103.48,61.72 104.55,60.66 105,60.66 U$4.28
RXD  (via drill 0.35)
  Top 0.152: v82.14,48.92 82.14,46.48 | 82.14,46.48 82.14,43.28 85.65,39.78 87.02,39.78 87.63,40.39 87.63,40.69 U$3.25 | v67.21,38.86 v65.23,40.84 | 82.14,46.48 v81.99,46.48
  Bottom 0.152: v82.14,48.92 82.14,71.78 IC2.12 | v65.23,40.84 64.47,40.84 IC1.2 | v67.21,38.86 68.58,38.86 69.95,37.49 73,37.49 v81.99,46.48
SCLK  (via drill 0.35)
  Top 0.152: T1.3 80.01,33.83 v78.49,35.36 71.17,42.67 71.17,43.13 68.89,45.41 v66.14,45.41 | v101.19,58.22 99.97,59.44 99.97,59.89 T2.3
  Bottom 0.152: v66.14,45.41 64.47,45.41 IC1.11 | v101.19,58.22 78.49,35.51 v78.49,35.36
SD-CLK-EN  (via drill 0.35)
  Top 0.152: v73.3,39.62 73.91,39.01 73.91,34.14 79.25,28.8 79.7,28.8 T1.1
  Bottom 0.152: v73.3,39.62 73.61,39.93 73.61,43.13 73.46,43.28 73,43.28 IC1.42
SDCLK
  Top 0.152: T1.2 80.31,28.8 80.31,28.65 80.47,28.5 80.47,28.35 77.42,25.3 77.42,13.56 76.96,13.11 75.59,13.11 U$1.7
TEMP-OUT  (via drill 0.35)
  Top 0.152: v62.33,45.26 v66.45,41.15 | v13.11,42.06 8.99,37.95 SV1.7
  Bottom 0.152: v66.45,41.15 66.9,40.69 66.9,39.93 IC1.60 | v62.33,45.26 16.31,45.26 v13.11,42.06
TRIG  (via drill 0.35)
  Top 0.152: v69.8,41.6 72.08,39.32 72.24,39.32 73.46,38.1 73.46,34.75 v73.3,34.59
  Bottom 0.152: v69.8,41.6 68.89,40.69 68.89,39.93 IC1.56 | v73.3,34.59 73.3,32.77 65.99,25.45 65.99,19.51 74.52,10.97 74.52,7.77 70.1,3.35 7.77,3.35 6.4,4.72 SV1.34
TXD  (via drill 0.35)
  Top 0.152: v81.38,48.31 81.38,43.59 85.5,39.47 87.17,39.47 88.09,40.39 88.09,40.69 U$3.26 | v65.23,43.28 65.23,46.18 v62.18,49.23
  Bottom 0.152: 81.38,50.9 81.38,70.26 79.86,71.78 IC2.11 | 81.38,50.9 v81.38,48.31 | v65.23,43.28 65.23,41.91 64.77,41.45 64.47,41.45 IC1.3 | v62.18,49.23 63.86,50.9 81.38,50.9
ULN-IN1  (via drill 0.35)
  Top 0.152: v71.32,51.51 v72.85,49.99 | v3.81,27.58 6.25,25.15 SV1.18
  Bottom 0.152: v72.85,49.99 72.54,49.68 72.54,48.46 IC1.32 | v71.32,51.51 68.89,53.95 11.58,53.95 3.81,46.18 v3.81,27.58
ULN-IN2  (via drill 0.35)
  Top 0.152: v71.93,47.55 71.93,48.16 73.46,49.68 73.46,50.29 v72.24,51.51 | v3.2,30.79 6.25,27.74 SV1.16
  Bottom 0.152: v71.93,47.55 71.93,48.31 IC1.31 | v72.24,51.51 69.49,54.25 11.43,54.25 3.2,46.02 v3.2,30.79
ULN-IN3  (via drill 0.35)
  Top 0.152: v69.04,46.79 68.89,46.94 66.14,46.94 61.87,51.21 v61.87,51.36
  Bottom 0.152: v69.04,46.79 70.1,46.79 71.32,48.01 71.32,48.31 IC1.30 | v61.87,51.36 43.74,51.36 41.15,48.77 7.32,48.77 4.72,46.18 4.72,31.85 6.25,30.33 SV1.14
ULN-IN4  (via drill 0.35)
  Top 0.152: v71.02,49.53 71.02,49.84 v69.34,51.51
  Bottom 0.152: v71.02,49.53 71.02,48.46 IC1.29 | v69.34,51.51 62.94,51.51 59.89,48.46 7.47,48.46 5.03,46.02 5.03,33.98 6.25,32.77 SV1.12
VBUS
  Top 0.152: U$3.8 89,45.26 89.15,45.11 89.31,45.11 89.76,44.65 U$3.7 89.92,44.65 89.92,45.11 90.22,45.41 94.49,45.41 94.64,45.57 C13.1 94.79,45.57 95.1,45.26 103.78,45.26 114.3,34.75 SV2.25
XTAL1  (via drill 0.35)
  Top 0.152: v68.43,47.55 68.43,48.31 67.06,49.68 67.06,53.49 66.14,54.41 66.14,54.86 Q1.3 65.99,54.86 65.23,54.86 64.47,55.63 64.47,58.37 65.38,59.28 65.38,60.66 C15.1
  Bottom 0.152: v68.43,47.55 68.43,48.31 IC1.24
XTAL2  (via drill 0.35)
  Top 0.152: v67.97,49.68 67.97,50.75 67.67,51.05 67.67,53.8 68.89,55.02 68.89,56.69 69.49,57.3 69.95,57.3 | 69.95,57.3 70.41,57.3 Q1.1 69.95,57.3 | 69.95,57.3 69.95,58.37 69.49,58.83 69.49,60.66 C14.1
  Bottom 0.152: v67.97,49.68 67.97,48.46 IC1.23
XTAL3
  Top 0.152: U$4.13 107.59,55.78 107.59,55.32 108.05,54.86 107.14,53.95 92.35,53.95 88.09,58.22 87.63,58.22 Q2.1 87.48,58.37 87.48,59.28 86.87,59.89 84.12,59.89 83.06,58.83 81.23,58.83 C17.1
XTAL4
  Top 0.152: U$4.12 106.98,55.78 106.98,55.47 107.29,55.17 107.29,54.86 106.68,54.25 94.18,54.25 87.48,60.96 85.8,60.96 85.04,61.72 85.04,62.64 Q2.3 85.04,62.79 81.23,62.79 C18.1